# Altium schematic sheet ESP_helper.SchDoc
size A
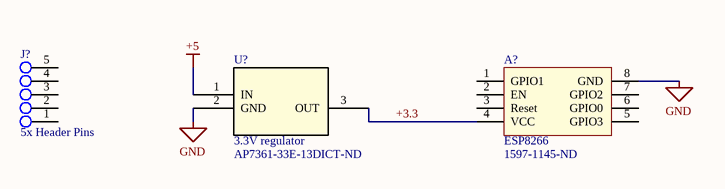
[diagram p0: ESP_helper.SchDoc]

## Parts
A?  ESP8266  Supplier Part Number 1: 1597-1145-ND  [ESP8266]
J?  5x Header Pins  [5 HEADER PIN]
U?  3.3V regulator  Supplier Part Number 1: AP7361-33E-13DICT-ND  [SOT-223]

## Nets
+5: U?.1(IN)
GND: A?.8(GND) U?.2(GND)
+3.3: A?.4(VCC) U?.3(OUT)

Not connected (* = marked no-connect by the designer): A? 1(GPIO1) 2(EN) 3(Reset) 5(GPIO3) 6(GPIO0) 7(GPIO2); J? 1 2 3 4 5

## Library data of the parts
A? = ESP8266: RX TXRX MODULE WIFI TRACE ANT TH; Supplier 1: Digi-Key
J? = 5x Header Pin: CONN HEADER VERT 5POS 2.54MM; Manufacturer_Part_Number: 77311-818-36LF; Vendor: Amphenol; Built_By: EMA_UL_Team; SourceLibrary: Amphenol_2013-08-06_Bergstik_1Row_77311; Copyright: Copyright (C) 2018 Accelerated Designs. All rights reserved; RefDes: RefDes; Type: DEV; Value: Value
U? = AP7361-33E-13: IC REG LINEAR 3.3V 1A SOT223; Vendor: Diodes Inc; Built_By: EMA_UL_Team; SourceLibrary: DIODESINC_2_2015-08-18; Manufacturer_Part_Number: AP7361-33E-13; Copyright: Copyright (C) 2018 Accelerated Designs. All rights reserved; RefDes: RefDes; Type: DEV; Supplier 1: Digi-Key